# Altium schematic sheet dcdc.schdoc
size 209 x 297 mm; PageSetup: Record=PageOptions|CenterHorizontal=False|CenterVertical=False|PrintScale=0.95|XCorrection=0.00|YCorrection=0.00|PrintKind=1|BorderSize=5000000|LeftOffset=0|BottomOffset=0|Orientation=1|PaperLength=1000|PaperWidth=1000|Scale=100|PaperSource=15|PrintQuality=600|MediaType=1|DitherType=10|PaperKind=A4|PrintScaleMode=1
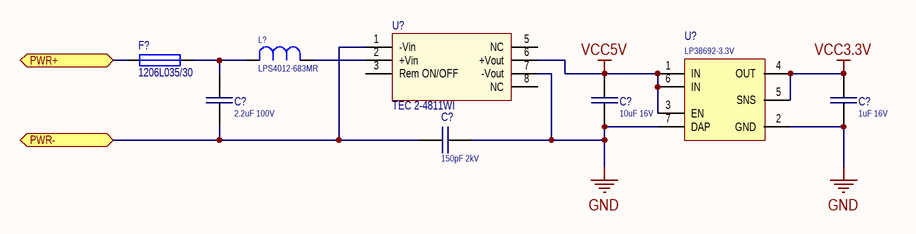
[diagram p0: dcdc.schdoc]

## Parts
(Parts that share a designator on the sheet are numbered #1, #2 ... from top to bottom, then left to right.)
C?#1  2.2uF 100V  [C_1206]
C?#2  10uF 16V  [C_1206]
C?#3  1uF 16V  [C_0603]
C?#4  150pF 2kV  [C_1206]
F?  1206L035/30  [FUSE_1206]
L?  value LPS4012-683MR  [LPS4012]  (hidden comment: LPS4012-224MR)
U?#1  TEC 2-4811WI  [SIP-8]
U?#2  LP38692-3.3V  [WSON-6]

## Ports
PWR+, PWR-

## Nets
GND: C?#2.2 C?#3.1 C?#4.1 U?#1.7(-Vout) U?#2.2(GND) U?#2.7(DAP)
VCC3.3V: C?#3.2 U?#2.4(OUT) U?#2.5(SNS)
VCC5V: C?#2.1 U?#1.6(+Vout) U?#2.1(IN) U?#2.3(EN) U?#2.6(IN)
PWR+: F?.1 ; port PWR+
PWR-: C?#1.2 C?#4.2 U?#1.1(-Vin) ; port PWR-
NetC?#1_1: C?#1.1 F?.2 L?.2
NetL?_1: L?.1 U?#1.2(+Vin)

Not connected (* = marked no-connect by the designer): U?#1 3(Rem_ON/OFF) 5(NC) 8(NC)

## Library data of the parts
C?#1 C?#2 C?#4 = C1206: Capacitor
  C?#1: Value: 2.2uF 100V
  C?#2: Value: 10uF 16V
  C?#4: Value: 150pF 2kV
C?#3 = C0603: Capacitor; Value: 1uF 16V
F? = Fuse_1206: Fuse
L? = L_LPS4012: Inductor
U?#2 = LP38692: LP38690, LP38692 1-A Low Dropout CMOS Linear Regulators  Stable with Ceramic Output Capacitors